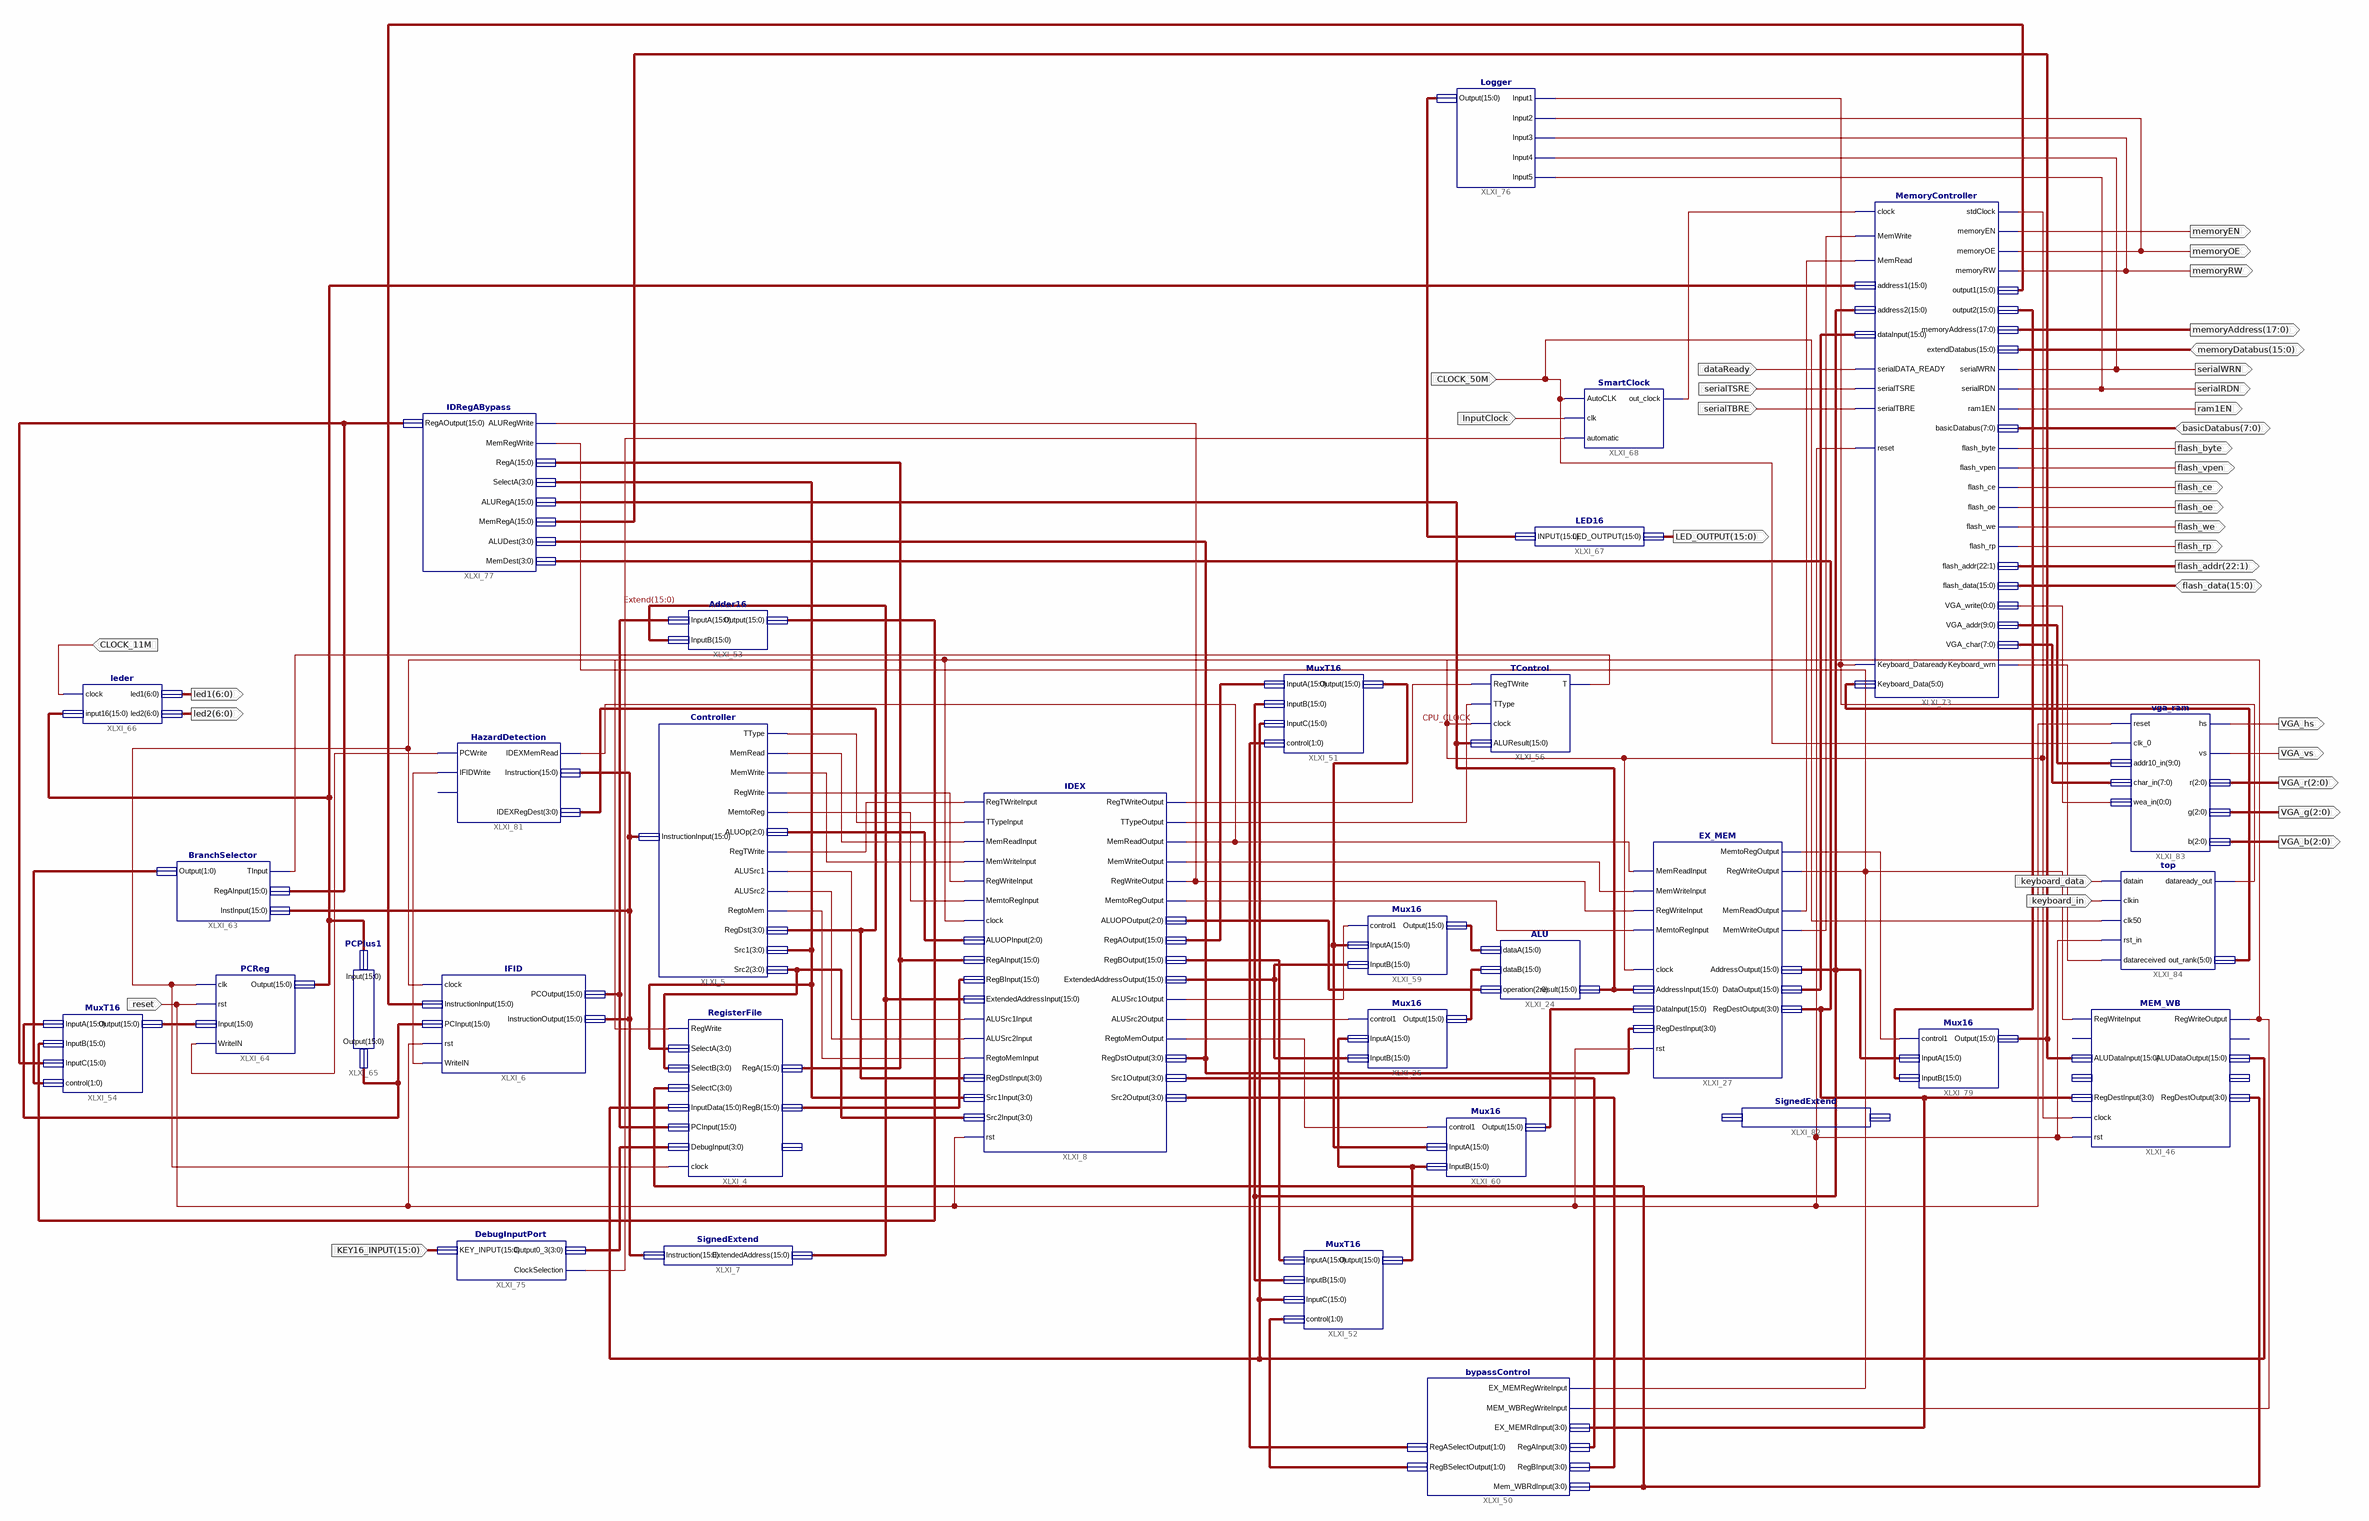
[diagram p0: schematic sheet 1]
// Xilinx ISE schematic Project.sch (spartan3e) as structural Verilog: 32 symbols, 35 ports
module Project (
  input  InputClock,
  input  reset,
  input  dataReady,
  input  serialTSRE,
  input  serialTBRE,
  input  CLOCK_50M,
  input  [15:0] KEY16_INPUT,
  input  CLOCK_11M,
  input  keyboard_data,
  input  keyboard_in,
  inout  [15:0] memoryDatabus,
  inout  [7:0] basicDatabus,
  inout  [15:0] flash_data,
  output [6:0] led1,
  output [6:0] led2,
  output [15:0] LED_OUTPUT,
  output memoryRW,
  output memoryEN,
  output [17:0] memoryAddress,
  output memoryOE,
  output serialWRN,
  output serialRDN,
  output ram1EN,
  output VGA_hs,
  output VGA_vs,
  output [2:0] VGA_r,
  output [2:0] VGA_g,
  output [2:0] VGA_b,
  output flash_byte,
  output flash_vpen,
  output flash_ce,
  output flash_oe,
  output flash_we,
  output flash_rp,
  output [22:1] flash_addr
);

  wire CPU_CLOCK, XLXN_374, XLXN_578, XLXN_598, XLXN_701, XLXN_702, XLXN_703, XLXN_704, XLXN_705, XLXN_707,
       XLXN_708, XLXN_709, XLXN_710, XLXN_713, XLXN_714, XLXN_716, XLXN_722, XLXN_724, XLXN_743, XLXN_851,
       XLXN_855, XLXN_856, XLXN_1007, XLXN_1008, XLXN_1014, XLXN_1028, XLXN_1032, XLXN_1042, XLXN_1074,
       XLXN_1125, XLXN_1127;
  wire [0:0] XLXN_1122;
  wire [1:0] XLXN_577, XLXN_731, XLXN_732;
  wire [2:0] XLXN_706, XLXN_759;
  wire [3:0] XLXN_668, XLXN_669, XLXN_711, XLXN_730, XLXN_733, XLXN_736, XLXN_760, XLXN_981, XLXN_985;
  wire [5:0] XLXN_1126;
  wire [7:0] XLXN_1124;
  wire [9:0] XLXN_1123;
  wire [15:0] Extend, instruction, XLXN_209, XLXN_661, XLXN_712, XLXN_727, XLXN_728, XLXN_739, XLXN_741,
       XLXN_744, XLXN_745, XLXN_768, XLXN_871, XLXN_984, XLXN_992, XLXN_995, XLXN_998, XLXN_999, XLXN_1004,
       XLXN_1009, XLXN_1011, XLXN_1021, XLXN_1024, XLXN_1043, XLXN_1045, XLXN_1075;

  Mux16 XLXI_25 (.control1(XLXN_714), .InputA(XLXN_739), .InputB(XLXN_728), .Output(XLXN_992));
  ALU XLXI_24 (.dataA(XLXN_1021), .dataB(XLXN_992), .operation(XLXN_759), .result(XLXN_1045));
  EX_MEM XLXI_27 (
    .MemReadInput(XLXN_1032), .MemWriteInput(XLXN_722), .RegWriteInput(XLXN_1007), .MemtoRegInput(XLXN_724),
    .clock(CPU_CLOCK), .rst(reset), .AddressInput(XLXN_1045), .DataInput(XLXN_744), .RegDestInput(XLXN_730),
    .MemtoRegOutput(XLXN_1008), .RegWriteOutput(XLXN_1014), .MemReadOutput(XLXN_855),
    .MemWriteOutput(XLXN_856), .AddressOutput(XLXN_999), .DataOutput(XLXN_871), .RegDestOutput(XLXN_760));
  SignedExtend XLXI_7 (.Instruction(instruction), .ExtendedAddress(Extend));
  RegisterFile XLXI_4 (
    .RegWrite(XLXN_374), .SelectA(XLXN_668), .SelectB(XLXN_669), .PCInput(XLXN_745), .SelectC(XLXN_985),
    .InputData(XLXN_995), .DebugInput(XLXN_981), .RegA(XLXN_1004), .RegB(XLXN_661), .clock(CPU_CLOCK));  // open: DebugOutput
  Controller XLXI_5 (
    .InstructionInput(instruction), .ALUSrc1(XLXN_708), .ALUSrc2(XLXN_709), .RegTWrite(XLXN_707),
    .TType(XLXN_701), .MemRead(XLXN_702), .MemWrite(XLXN_703), .RegWrite(XLXN_704), .MemtoReg(XLXN_705),
    .RegtoMem(XLXN_710), .RegDst(XLXN_711), .ALUOp(XLXN_706), .Src1(XLXN_668), .Src2(XLXN_669));
  IFID XLXI_6 (
    .clock(CPU_CLOCK), .rst(reset), .InstructionInput(XLXN_1075), .PCInput(XLXN_209),
    .InstructionOutput(instruction), .PCOutput(XLXN_745), .WriteIN(XLXN_1074));
  MEM_WB XLXI_46 (
    .RegWriteInput(XLXN_1014), .clock(CPU_CLOCK), .ALUDataInput(XLXN_1011), .RegDestInput(XLXN_760),
    .RegWriteOutput(XLXN_374), .ALUDataOutput(XLXN_995), .RegDestOutput(XLXN_985), .rst(reset));  // open: MemtoRegInput, ReadDataInput, MemtoRegOutput, ReadDataOutput
  bypassControl XLXI_50 (
    .EX_MEMRegWriteInput(XLXN_1014), .MEM_WBRegWriteInput(XLXN_374), .RegAInput(XLXN_733),
    .RegBInput(XLXN_736), .EX_MEMRdInput(XLXN_760), .Mem_WBRdInput(XLXN_985), .RegASelectOutput(XLXN_732),
    .RegBSelectOutput(XLXN_731));
  MuxT16 XLXI_51 (.InputA(XLXN_984), .InputB(XLXN_999), .InputC(XLXN_995), .control(XLXN_732), .Output(XLXN_741));
  MuxT16 XLXI_52 (.InputA(XLXN_727), .InputB(XLXN_999), .InputC(XLXN_995), .control(XLXN_731), .Output(XLXN_739));
  Adder16 XLXI_53 (.InputA(XLXN_745), .InputB(Extend), .Output(XLXN_712));
  MuxT16 XLXI_54 (.InputA(XLXN_209), .InputB(XLXN_712), .InputC(XLXN_1024), .control(XLXN_577), .Output(XLXN_768));
  TControl XLXI_56 (.RegTWrite(XLXN_598), .TType(XLXN_716), .clock(CPU_CLOCK), .ALUResult(XLXN_1045), .T(XLXN_578));
  IDEX XLXI_8 (
    .RegTWriteInput(XLXN_707), .ALUSrc1Input(XLXN_708), .ALUSrc2Input(XLXN_709), .TTypeInput(XLXN_701),
    .MemReadInput(XLXN_702), .MemWriteInput(XLXN_703), .RegWriteInput(XLXN_704), .MemtoRegInput(XLXN_705),
    .RegtoMemInput(XLXN_710), .clock(CPU_CLOCK), .RegDstInput(XLXN_711), .ALUOPInput(XLXN_706),
    .RegAInput(XLXN_1004), .RegBInput(XLXN_661), .Src1Input(XLXN_668), .Src2Input(XLXN_669),
    .ExtendedAddressInput(Extend), .RegTWriteOutput(XLXN_598), .ALUSrc1Output(XLXN_713),
    .ALUSrc2Output(XLXN_714), .TTypeOutput(XLXN_716), .MemReadOutput(XLXN_1032), .MemWriteOutput(XLXN_722),
    .RegWriteOutput(XLXN_1007), .MemtoRegOutput(XLXN_724), .RegtoMemOutput(XLXN_743),
    .RegDstOutput(XLXN_730), .ALUOPOutput(XLXN_759), .RegAOutput(XLXN_984), .RegBOutput(XLXN_727),
    .Src1Output(XLXN_733), .Src2Output(XLXN_736), .ExtendedAddressOutput(XLXN_728), .rst(reset));
  Mux16 XLXI_59 (.control1(XLXN_713), .InputA(XLXN_741), .InputB(XLXN_728), .Output(XLXN_1021));
  Mux16 XLXI_60 (.control1(XLXN_743), .InputA(XLXN_741), .InputB(XLXN_739), .Output(XLXN_744));
  BranchSelector XLXI_63 (.TInput(XLXN_578), .RegAInput(XLXN_1024), .InstInput(instruction), .Output(XLXN_577));
  PCReg XLXI_64 (.clk(CPU_CLOCK), .rst(reset), .Input(XLXN_768), .Output(XLXN_1043), .WriteIN(XLXN_1028));
  PCPlus1 XLXI_65 (.Input(XLXN_1043), .Output(XLXN_209));
  leder XLXI_66 (.clock(CLOCK_11M), .input16(XLXN_1043), .led1(led1), .led2(led2));
  LED16 XLXI_67 (.INPUT(XLXN_998), .LED_OUTPUT(LED_OUTPUT));
  SmartClock XLXI_68 (.AutoCLK(CLOCK_50M), .clk(InputClock), .\automatic (XLXN_1042), .out_clock(XLXN_851));
  MemoryController XLXI_73 (
    .clock(XLXN_851), .MemWrite(XLXN_856), .MemRead(XLXN_855), .serialDATA_READY(dataReady),
    .serialTSRE(serialTSRE), .serialTBRE(serialTBRE), .reset(reset), .address1(XLXN_1043),
    .address2(XLXN_999), .dataInput(XLXN_871), .extendDatabus(memoryDatabus), .basicDatabus(basicDatabus),
    .flash_data(flash_data), .stdClock(CPU_CLOCK), .memoryEN(memoryEN), .memoryOE(memoryOE),
    .memoryRW(memoryRW), .serialWRN(serialWRN), .serialRDN(serialRDN), .ram1EN(ram1EN),
    .flash_byte(flash_byte), .flash_vpen(flash_vpen), .flash_ce(flash_ce), .flash_oe(flash_oe),
    .flash_we(flash_we), .flash_rp(flash_rp), .output1(XLXN_1075), .output2(XLXN_1009),
    .memoryAddress(memoryAddress), .flash_addr(flash_addr), .VGA_addr(XLXN_1123), .VGA_write(XLXN_1122[0]),
    .VGA_char(XLXN_1124), .Keyboard_Dataready(XLXN_1125), .Keyboard_Data(XLXN_1126), .Keyboard_wrn(XLXN_1127));
  DebugInputPort XLXI_75 (.KEY_INPUT(KEY16_INPUT), .Output0_3(XLXN_981), .ClockSelection(XLXN_1042));
  Logger XLXI_76 (
    .Input1(XLXN_1125), .Input2(memoryOE), .Input3(memoryRW), .Input4(serialWRN), .Input5(serialRDN),
    .Output(XLXN_998));
  IDRegABypass XLXI_77 (
    .ALURegWrite(XLXN_1007), .MemRegWrite(XLXN_1014), .RegA(XLXN_1004), .SelectA(XLXN_668),
    .ALURegA(XLXN_1045), .MemRegA(XLXN_1011), .ALUDest(XLXN_730), .MemDest(XLXN_760), .RegAOutput(XLXN_1024));
  Mux16 XLXI_79 (.control1(XLXN_1008), .InputA(XLXN_999), .InputB(XLXN_1009), .Output(XLXN_1011));
  HazardDetection XLXI_81 (
    .IDEXMemRead(XLXN_1032), .Instruction(instruction), .PCWrite(XLXN_1028), .IFIDWrite(XLXN_1074),
    .IDEXRegDest(XLXN_711));  // open: CtrlSignal
  SignedExtend XLXI_82 ();  // open: Instruction, ExtendedAddress
  vga_ram XLXI_83 (
    .reset(reset), .clk_0(CLOCK_50M), .hs(VGA_hs), .vs(VGA_vs), .r(VGA_r), .g(VGA_g), .b(VGA_b),
    .addr10_in(XLXN_1123), .char_in(XLXN_1124), .wea_in(XLXN_1122[0]));
  top XLXI_84 (
    .datain(keyboard_data), .clkin(keyboard_in), .clk50(CLOCK_50M), .rst_in(reset), .datareceived(XLXN_1127),
    .dataready_out(XLXN_1125), .out_rank(XLXN_1126));
endmodule
